# Altium schematic sheet EPS_MPPT_XY_Measurements.SchDoc: MPPT-X and MPPT-Y / Measurements
size A4
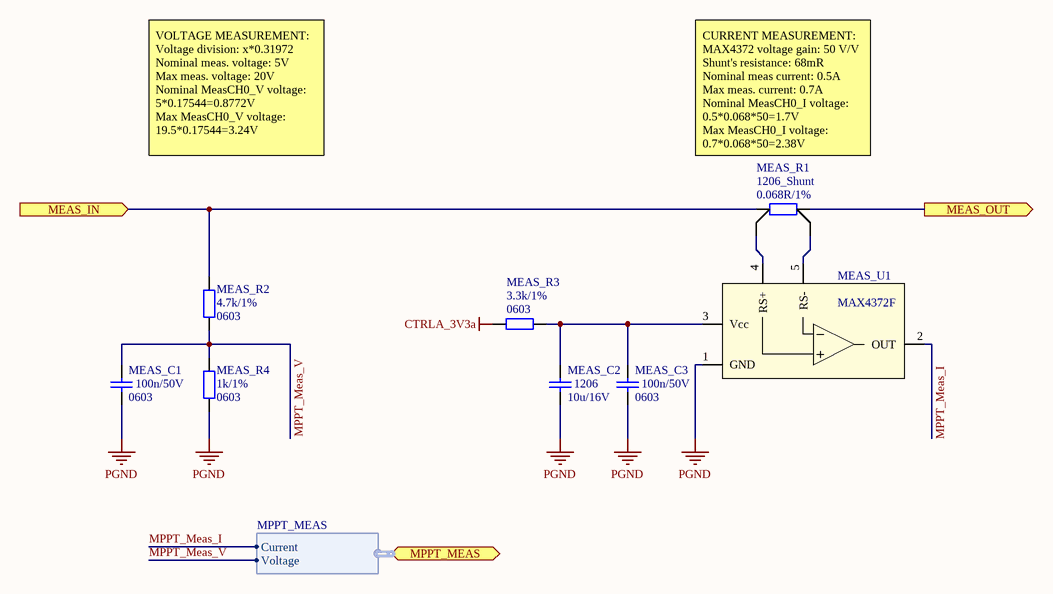
[diagram p0: EPS_MPPT_XY_Measurements.SchDoc]

## Parts
MEAS_C1  Package: 0603  [SMD_Capacitor_0603]  (hidden comment: 100n/50V)
MEAS_C2  Packge: 1206  [SMD_Capacitor_1206]  (hidden comment: 10u/16V)
MEAS_C3  Package: 0603  [SMD_Capacitor_0603]  (hidden comment: 100n/50V)
MEAS_R1  Package: 1206_Shunt  [SMD_Resistor-Shunt_1206]  (hidden comment: 0.068R/1%)
MEAS_R2  Package: 0603  [SMD_Resistor_0603]  (hidden comment: 4.7k/1%)
MEAS_R3  Package: 0603  [SMD_Resistor_0603]  (hidden comment: 3.3k/1%)
MEAS_R4  Package: 0603  [SMD_Resistor_0603]  (hidden comment: 1k/1%)
MEAS_U1  MAX4372F  [SOT23-5]

## Ports
MEAS_IN (in), MEAS_OUT (out), MPPT_MEAS (harness MPPT_MEAS)

## Harnesses
MPPT_MEAS: Voltage, Current

## Nets
CTRLA_3V3a: MEAS_R3.1
PGND: MEAS_C1.2 MEAS_C2.2 MEAS_C3.2 MEAS_R4.2 MEAS_U1.1(GND)
MEAS_IN: MEAS_R1.1 MEAS_R2.1 ; port MEAS_IN
MEAS_OUT: MEAS_R1.4 ; port MEAS_OUT
MPPT_Meas_I: MEAS_U1.2(OUT) ; port MPPT_MEAS.Current
MPPT_Meas_V: MEAS_C1.1 MEAS_R2.2 MEAS_R4.1 ; port MPPT_MEAS.Voltage
NetMEAS_C2_1: MEAS_C2.1 MEAS_C3.1 MEAS_R3.2 MEAS_U1.3(Vcc)
NetMEAS_R1_2: MEAS_R1.2 MEAS_U1.4(RS+)
NetMEAS_R1_3: MEAS_R1.3 MEAS_U1.5(RS-)

## Notes on the sheet
- VOLTAGE MEASUREMENT:
  Voltage division: x*0.31972
  Nominal meas. voltage: 5V
  Max meas. voltage: 20V
  Nominal MeasCH0_V voltage: 5*0.17544=0.8772V
  Max MeasCH0_V voltage: 19.5*0.17544=3.24V
- CURRENT MEASUREMENT:
  MAX4372 voltage gain: 50 V/V
  Shunt's resistance: 68mR
  Nominal meas current: 0.5A
  Max meas. current: 0.7A
  Nominal MeasCH0_I voltage: 0.5*0.068*50=1.7V
  Max MeasCH0_I voltage: 0.7*0.068*50=2.38V
- Title:
- Project:
- Author:
- Model:
- Document Number:
- Checked by:
- Rev:
- Date:
- Approved by:
- Sheet:
- of
- File name:

## Library data of the parts
MEAS_C1 MEAS_C3 = Cer_C0603T104K5RALTU: Ceramic Cap Kemet COTS 100n/50V X7R 0603; Manufacturer: Kemet; ManufacturerPartNumber: C0603T104K5RALTU; Value: 100n/50V
MEAS_C2 = Cer_C1206T106K4RACTU: Ceramic Cap Kemet COTS 10u/16V X7R 1206; ManufacturerPartNumber: C1206T106K4RACTU; Manufacturer: Kemet; Value: 10u/16V
MEAS_R1 = ERJ-8BWFR068V: Panasonic Resistor 68mR 1% 1206 1W; Manufacturer: Panasonic; ManufacturerPartNumber: ERJ-8BWFR068V; Value: 0.068R/1%
MEAS_R2-MEAS_R4 = Res
  MEAS_R2: Value: 4.7k/1%
  MEAS_R3: Value: 3.3k/1%
  MEAS_R4: Value: 1k/1%
MEAS_U1 = MAX4372: High-Side Current-Sense Amplifier with Voltage Output; Manufacturer: Maxim Integrated Products; Value: MAX4372F